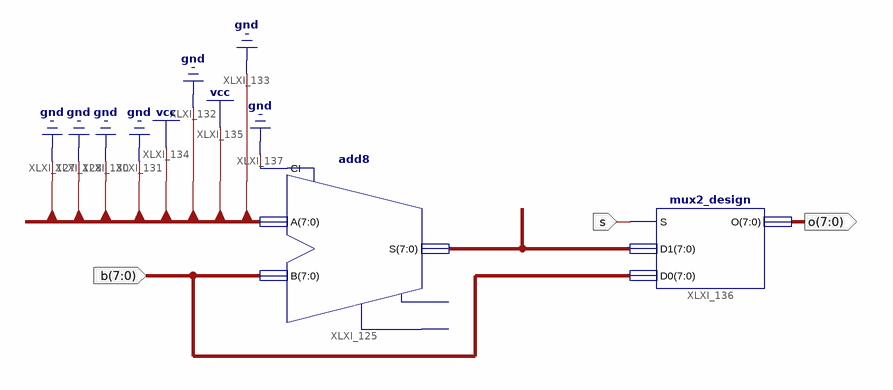
[diagram p0: schematic sheet 1]
// Xilinx ISE schematic addten_design.sch (spartan3) as structural Verilog: 2 symbols, 3 ports
module addten_design (
  input  [7:0] b,
  input  s,
  output [7:0] o
);

  wire [7:0] t;

  add8 XLXI_125 (.A(8'b00001010), .B(b), .CI(1'b0), .S(t));  // open: CO, OFL
  mux2_design XLXI_136 (.S(s), .D1(t), .D0(b), .O(o));
endmodule
